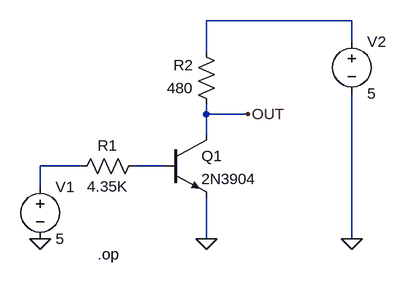
[diagram p0: schematic test_condition_inverter.asc]
test_condition_inverter.asc, the LTspice schematic file:
Version 4
SHEET 1 880 900
WIRE 512 -96 288 -96
WIRE 512 -64 512 -96
WIRE 288 -48 288 -96
WIRE 288 48 288 32
WIRE 352 48 288 48
WIRE 288 80 288 48
WIRE 96 128 32 128
WIRE 224 128 176 128
WIRE 32 160 32 128
WIRE 288 240 288 176
WIRE 512 240 512 16
FLAG 288 240 0
FLAG 32 240 0
FLAG 352 48 OUT
FLAG 512 240 0
SYMBOL npn 224 80 R0
SYMATTR InstName Q1
SYMATTR Value 2N3904
SYMBOL res 192 112 R90
WINDOW 0 0 56 VBottom 2
WINDOW 3 32 56 VTop 2
SYMATTR InstName R1
SYMATTR Value 4.35K
SYMBOL res 304 48 R180
WINDOW 0 36 76 Left 2
WINDOW 3 36 40 Left 2
SYMATTR InstName R2
SYMATTR Value 480
SYMBOL voltage 32 144 R0
WINDOW 123 0 0 Left 0
WINDOW 39 0 0 Left 0
SYMATTR InstName V1
SYMATTR Value 5
SYMBOL voltage 512 -80 R0
WINDOW 123 0 0 Left 0
WINDOW 39 0 0 Left 0
SYMATTR InstName V2
SYMATTR Value 5
TEXT 120 264 Left 2 !.op

The netlist it stands for:
* test_condition_inverter.asc
Q1 OUT N003 0 0 2N3904
R1 N003 N002 4.35K
R2 OUT N001 480
V1 N002 0 5
V2 N001 0 5
.model NPN NPN
.model PNP PNP
.lib standard.bjt
.op
.backanno
.end